# EAGLE design LF_sensors (EAGLE 9.6.2)
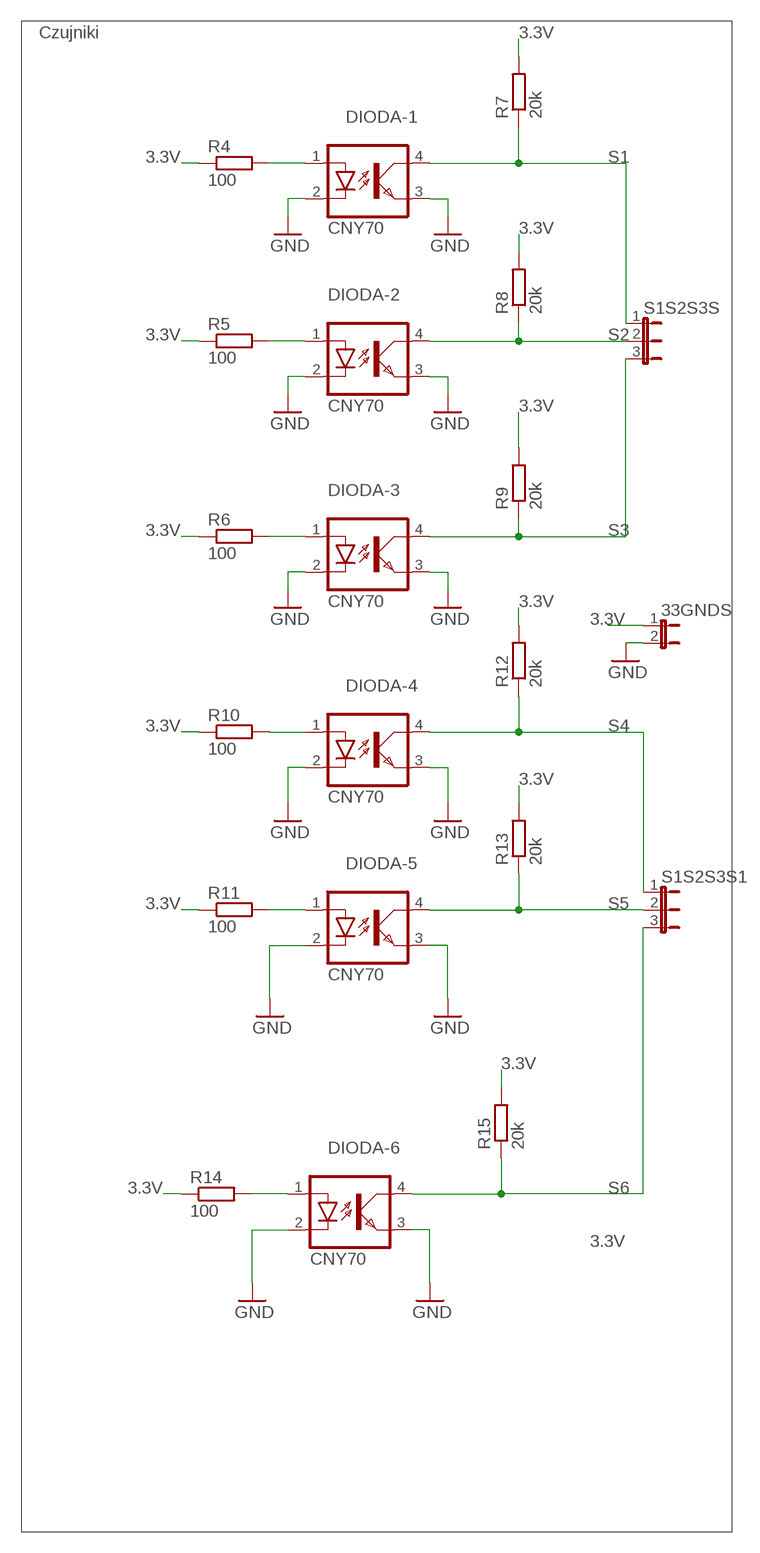
[diagram p0: schematic, sheet 1]

## Parts
33GNDS  JP1E  [JP1]
DIODA-1  CNY70  LTV816  [DIL04]
DIODA-2  CNY70  LTV816  [DIL04]
DIODA-3  CNY70  LTV816  [DIL04]
DIODA-4  CNY70  LTV816  [DIL04]
DIODA-5  CNY70  LTV816  [DIL04]
DIODA-6  CNY70  LTV816  [DIL04]
R4  100  R-EU_R0805  [R0805]
R5  100  R-EU_R0805  [R0805]
R6  100  R-EU_R0805  [R0805]
R7  20k  R-EU_R0805  [R0805]
R8  20k  R-EU_R0805  [R0805]
R9  20k  R-EU_R0805  [R0805]
R10  100  R-EU_R0805  [R0805]
R11  100  R-EU_R0805  [R0805]
R12  20k  R-EU_R0805  [R0805]
R13  20k  R-EU_R0805  [R0805]
R14  100  R-EU_R0805  [R0805]
R15  20k  R-EU_R0805  [R0805]
S1S2S3S  JP2E  [JP2]
S1S2S3S1  JP2E  [JP2]

## Nets
3.3V: 33GNDS.1 R4.1 R5.1 R6.1 R7.2 R8.2 R9.2 R10.1 R11.1 R12.2 R13.2 R14.1 R15.2
GND: 33GNDS.2 DIODA-1.2(C) DIODA-1.3(EMIT) DIODA-2.2(C) DIODA-2.3(EMIT) DIODA-3.2(C) DIODA-3.3(EMIT) DIODA-4.2(C) DIODA-4.3(EMIT) DIODA-5.2(C) DIODA-5.3(EMIT) DIODA-6.2(C) DIODA-6.3(EMIT)
N$2: DIODA-6.1(A) R14.2
N$8: DIODA-1.1(A) R4.2
N$9: DIODA-2.1(A) R5.2
N$10: DIODA-3.1(A) R6.2
N$11: DIODA-4.1(A) R10.2
N$14: DIODA-5.1(A) R11.2
S1: DIODA-1.4(COL) R7.1 S1S2S3S.1
S2: DIODA-2.4(COL) R8.1 S1S2S3S.2
S3: DIODA-3.4(COL) R9.1 S1S2S3S.3
S4: DIODA-4.4(COL) R12.1 S1S2S3S1.1
S5: DIODA-5.4(COL) R13.1 S1S2S3S1.2
S6: DIODA-6.4(COL) R15.1 S1S2S3S1.3

## Notes on the sheet
- Czujniki

## Library data of the parts
33GNDS = jumper:JP1E: JUMPER
DIODA-1-DIODA-6 = optocoupler:LTV816: OPTO COUPLER Source: LITEON, LTV816.pdf; OC_FARNELL: unknown; OC_NEWARK: unknown
R4-R15 = rcl:R-EU_: RESISTOR, European symbol; SPICEPREFIX: R
S1S2S3S S1S2S3S1 = jumper:JP2E: JUMPER

## Board
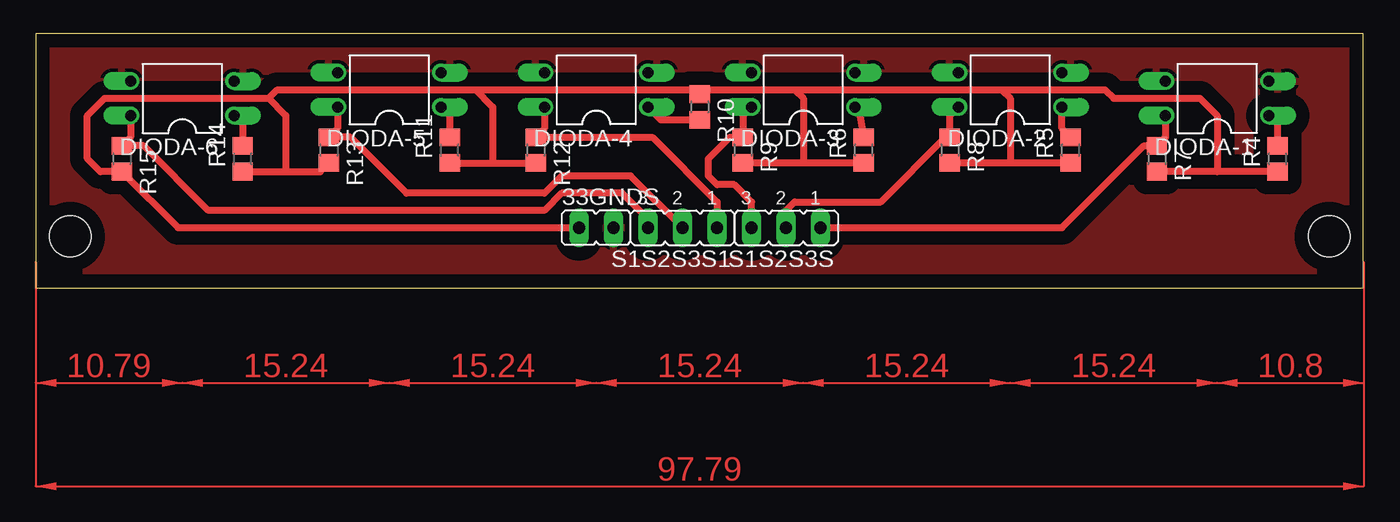
[diagram p1: board, top side]

Size 97.77 x 18.72 mm. Coordinates in mm from the lower left corner, seen from the top.
Outline: 0,0 97.77,0 97.77,18.72 0,18.72 0,0
Copper layers (1*16): Top 0.035mm / dielectric 1.5mm / Bottom 0.035mm
Design rules "default": minimum track width 6mil, minimum drill 0.35mm, track to track 6mil, track to pad 6mil, pad to pad 6mil, via to via 6mil, smd to smd 6mil, copper to edge 40mil, drill to drill 6mil, minimum pad ring 10mil, minimum via ring 8mil, stop-mask expansion 4mil, vias tented up to drill 0mil, thermal gap 10mil
Holes 3.05 mm at 2.54,3.81 95.25,3.81

### Footprints (pad centres in the part's own frame; a part is rotated, then mirrored left to right if it is on the bottom)
JP1 = drill 0.914 long: 1 0,-1.27; 2 0,1.27
DIL04 = drill 0.813 offset: 1 -1.27,-3.81; 2 1.27,-3.81; 3 1.27,3.81; 4 -1.27,3.81
R0805 = smd 1.3 x 1.5: 1 -0.95,0; 2 0.95,0
JP2 = drill 0.914 long: 1 -2.54,0; 2 0,0; 3 2.54,0

### Placement (x,y rotation side)
33GNDS  41.27,4.45 270 top
DIODA-1  87,13.97 90 top
DIODA-2  71.75,14.6 90 top
DIODA-3  56.52,14.6 90 top
DIODA-4  41.27,14.6 90 top
DIODA-5  26.04,14.6 90 top
DIODA-6  10.79,13.97 90 top
R4  91.44,9.53 90 top
R5  76.2,10.16 90 top
R6  60.96,10.16 90 top
R7  82.55,9.53 270 top
R8  67.31,10.16 270 top
R9  52.07,10.16 270 top
R10  48.9,13.33 270 top
R11  30.48,10.16 90 top
R12  36.83,10.16 270 top
R13  21.59,10.16 270 top
R14  15.24,9.53 90 top
R15  6.35,9.53 270 top
S1S2S3S  55.24,4.45 180 top
S1S2S3S1  47.62,4.45 180 top

### Tracks (layer width: path | path; a pad name or v marks a point on that pad's centre or on a via)
3.3V
  Top 0.508: R4.1 87,8.57 | 87,8.57 R7.2 | R5.1 71.75,9.21 | 71.75,9.21 R8.2 | R6.1 56.52,9.21 | 56.52,9.21 R9.2 | R11.1 33.66,9.21 | 33.66,9.21 R12.2 | R14.1 18.41,8.57 | 18.41,8.57 20.95,8.57 R13.2 | 33GNDS.1 10.48,4.45 R15.2 4.76,8.57 3.81,9.53 3.81,12.7 5.08,13.97 17.14,13.97 | 17.14,13.97 18.41,12.7 18.41,8.57 | 17.14,13.97 17.78,14.6 32.38,14.6 | 32.38,14.6 33.66,13.33 33.66,9.21 | 32.38,14.6 48.58,14.6 R10.1 49.21,14.29 49.53,14.6 55.88,14.6 | 55.88,14.6 56.52,13.97 56.52,9.21 | 55.88,14.6 71.12,14.6 | 71.12,14.6 71.75,13.97 71.75,9.21 | 71.12,14.6 78.74,14.6 79.38,13.97 85.72,13.97 87,12.7 87,8.57
GND
  pour Top (isolate 1.016): -9.53,30.48 -5.08,26.04 -5.08,-6.99 101.6,-6.99 102.23,-6.35 102.23,24.77 96.52,30.48
N$2
  Top 0.508: DIODA-6.1 15.24,12.06 R14.2
N$8
  Top 0.508: R4.2 91.44,12.06 DIODA-1.1
N$9
  Top 0.508: R5.2 75.56,11.74 DIODA-2.1
N$10
  Top 0.508: DIODA-3.1 60.55,13.56 R6.2
N$11
  Top 0.508: R10.2 46.03,12.38 DIODA-4.1
N$14
  Top 0.508: DIODA-5.1 30.48,12.7 R11.2
S1
  Top 0.508: S1S2S3S.1 75.56,4.45 81.59,10.47 R7.1 83.19,11.11 DIODA-1.4
S2
  Top 0.508: S1S2S3S.2 55.24,5.71 55.88,6.35 62.23,6.35 66.99,11.11 R8.1 67.31,12.7 DIODA-2.4
S3
  Top 0.508: S1S2S3S.3 52.7,6.35 51.44,7.62 50.16,7.62 49.53,8.25 49.53,9.53 51.12,11.11 R9.1 52.07,12.7 DIODA-3.4
S4
  Top 0.508: S1S2S3S1.1 50.16,6.35 45.41,11.11 R12.1 37.47,11.74 DIODA-4.4
S5
  Top 0.508: S1S2S3S1.2 43.81,8.25 38.73,8.25 37.47,6.99 27.3,6.99 23.18,11.11 R13.1 22.23,11.74 DIODA-5.4
S6
  Top 0.508: S1S2S3S1.3 45.09,5.08 43.18,6.99 38.73,6.99 37.47,5.71 12.7,5.71 7.94,10.47 R15.1 6.99,11.11 DIODA-6.4
(copper drawn outside any net)
  shapes: Top area x8